# EAGLE schematic module (EAGLE 9.6.2)

## Sheet 1 of 4
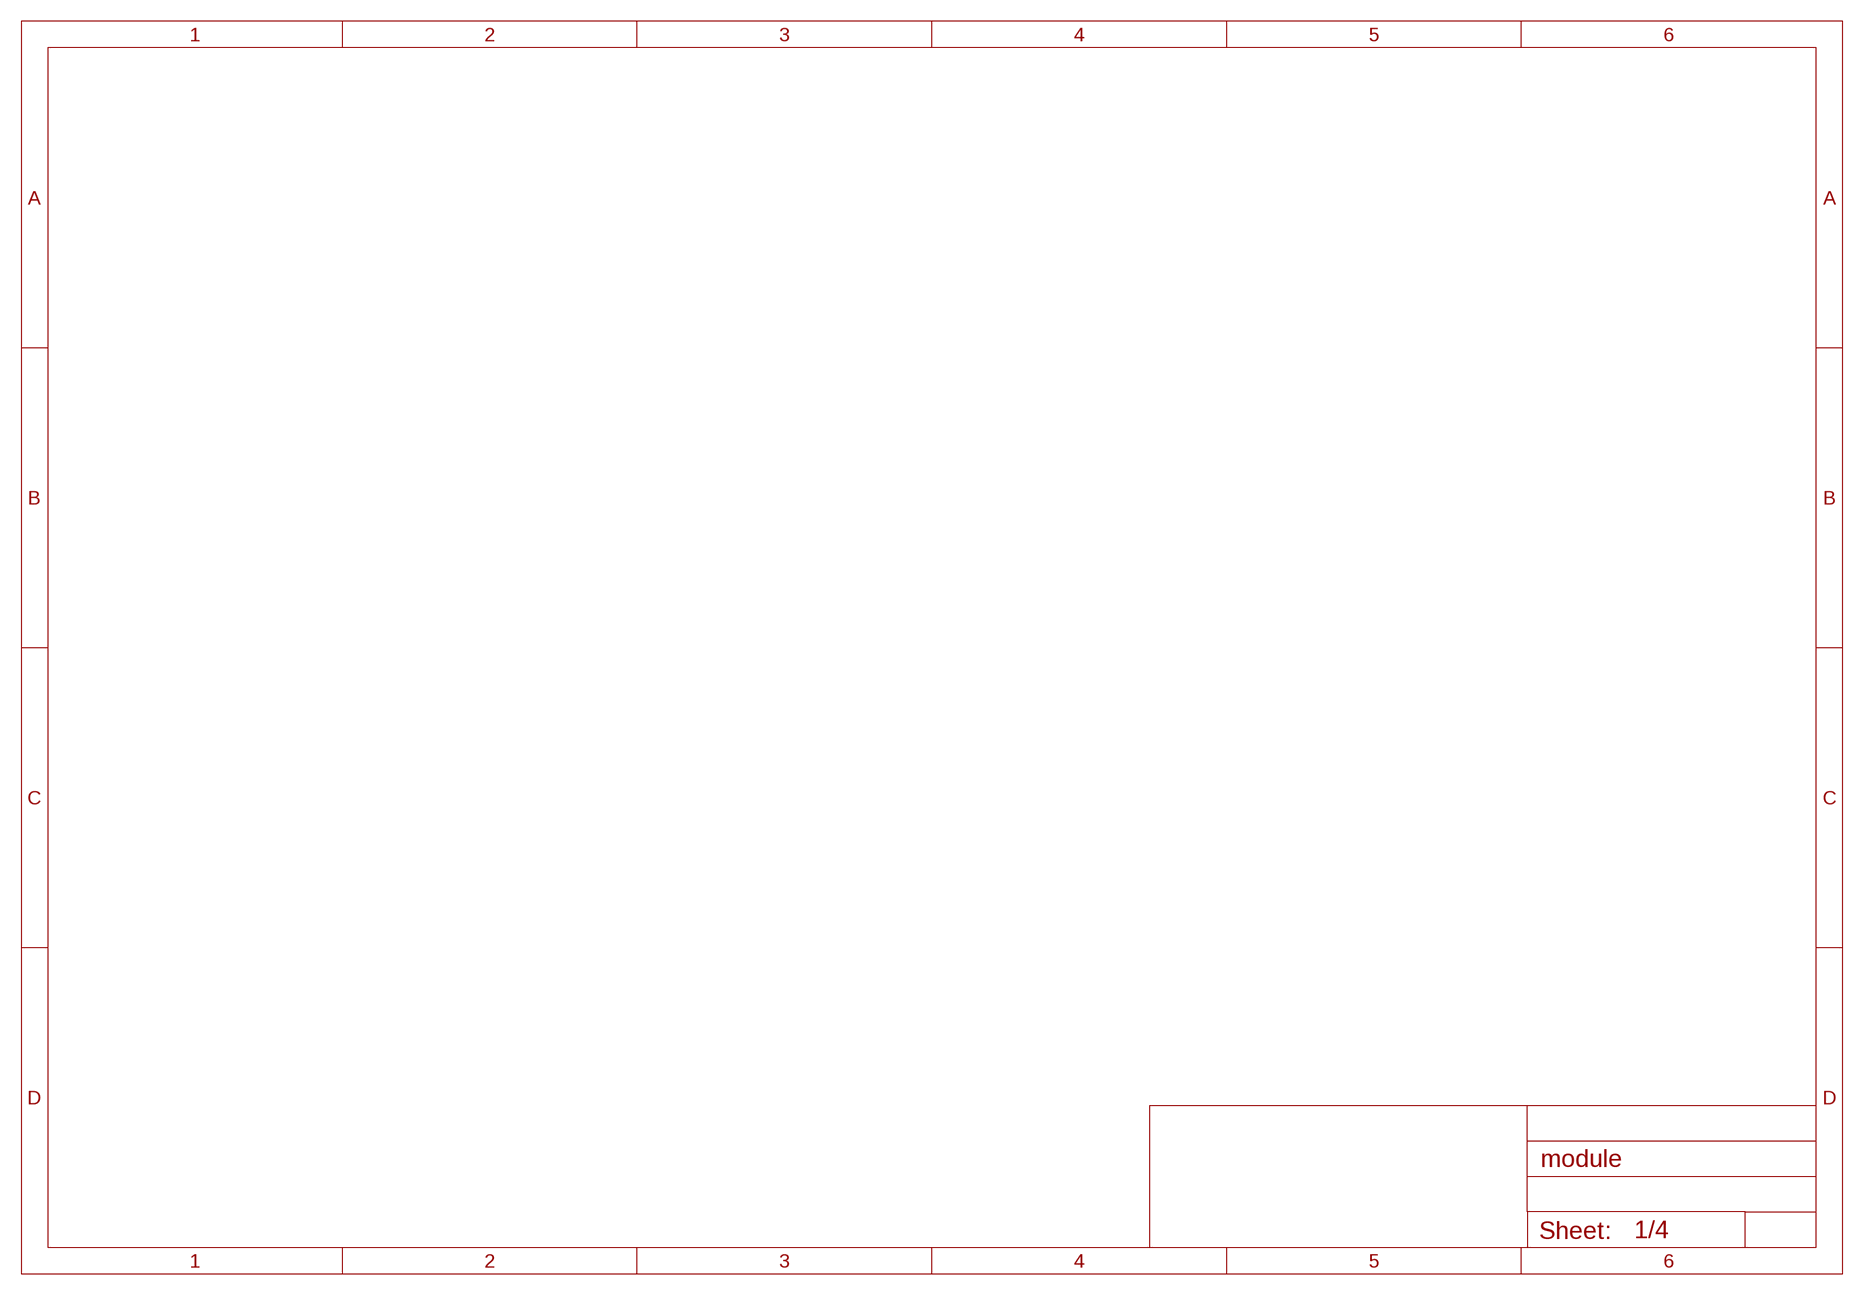
[diagram p0: schematic, sheet 1]

## Sheet 2 of 4
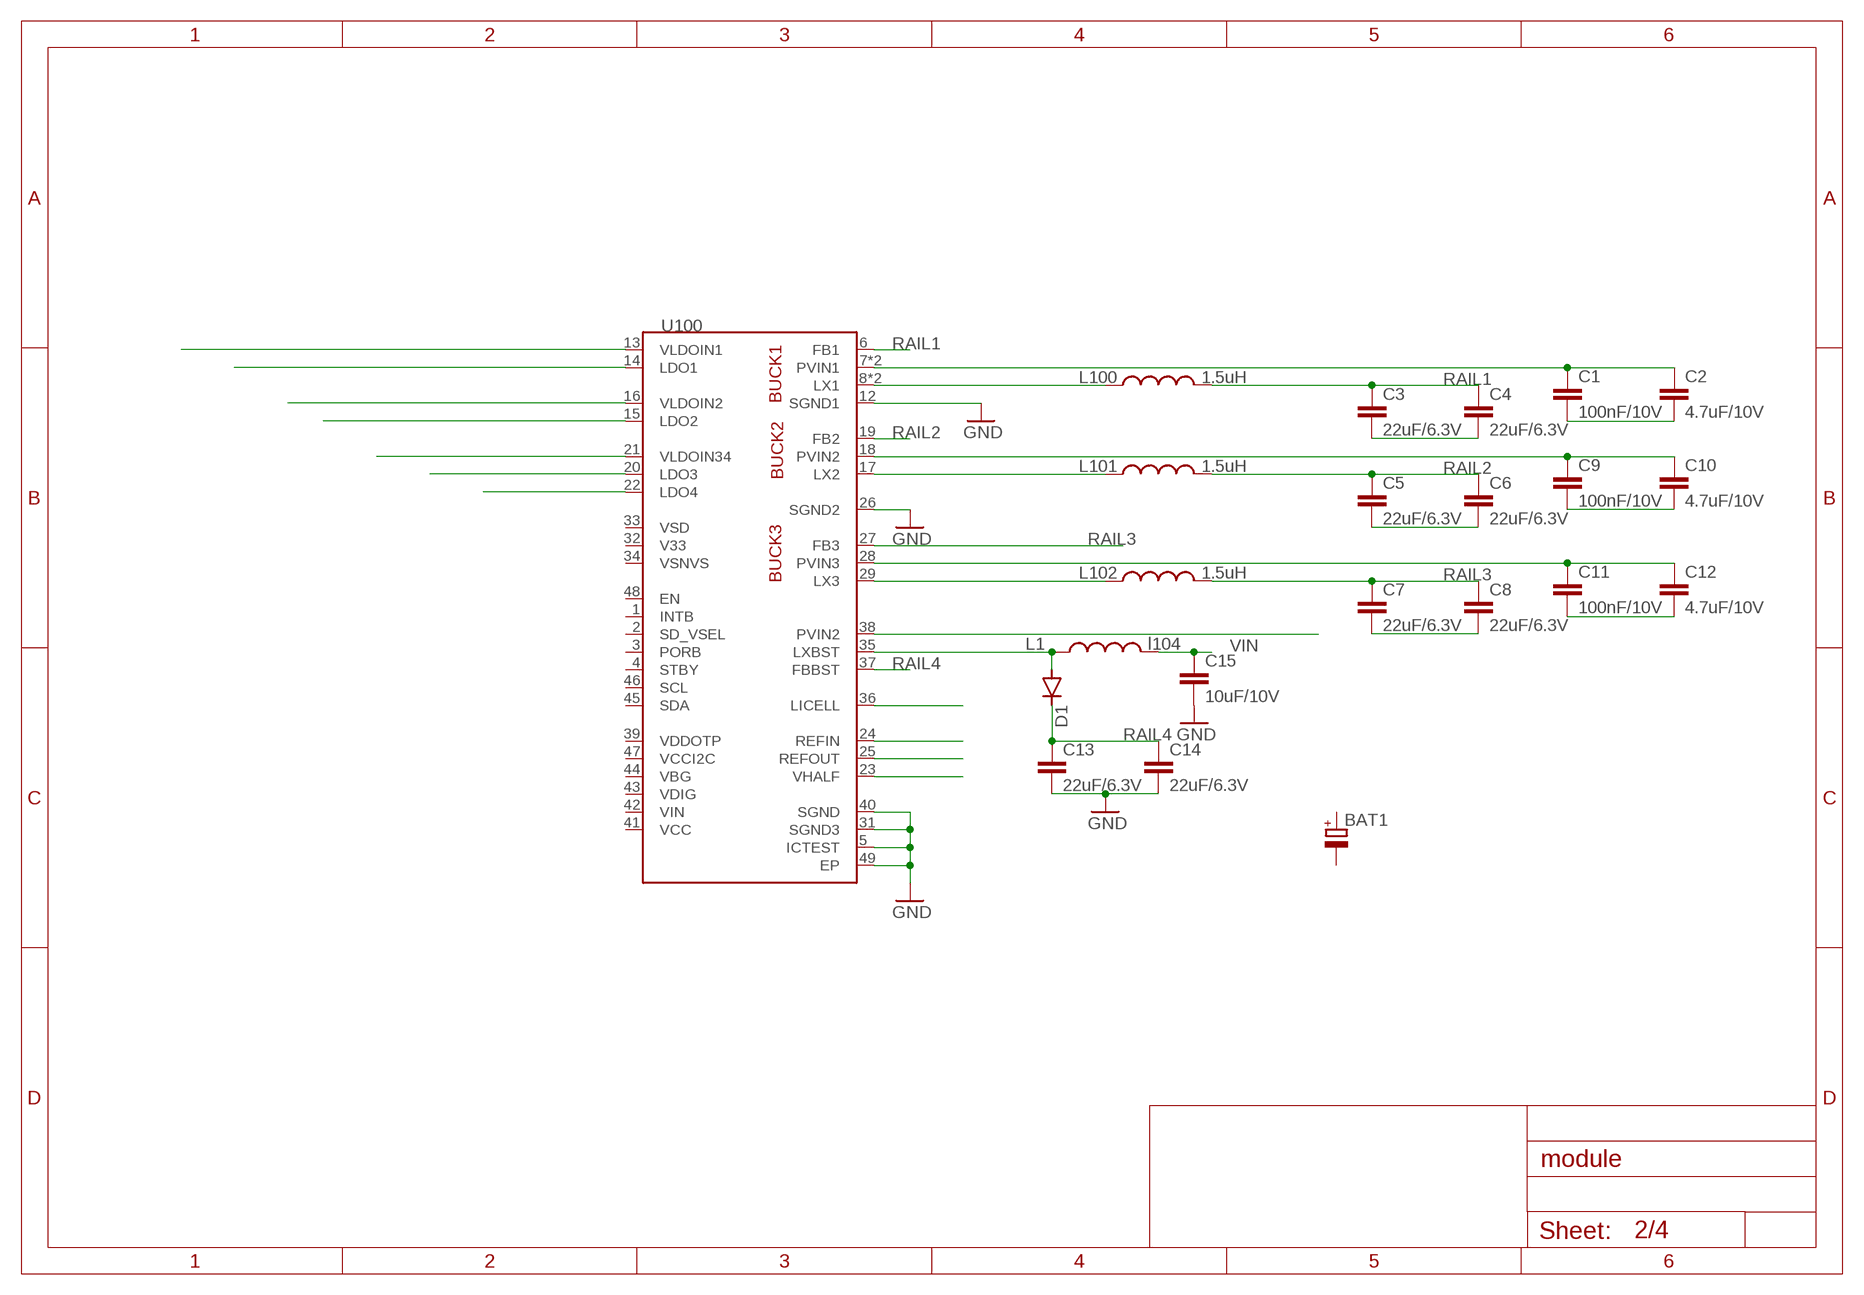
[diagram p1: schematic, sheet 2]

### Parts
BAT1  DCK-3R3E224U-E  [621]
C1  100nF/10V  C-EUC0603  [C0603]
C2  4.7uF/10V  C-EUC0603  [C0603]
C3  22uF/6.3V  C-EUC0805  [C0805]
C4  22uF/6.3V  C-EUC0805  [C0805]
C5  22uF/6.3V  C-EUC0805  [C0805]
C6  22uF/6.3V  C-EUC0805  [C0805]
C7  22uF/6.3V  C-EUC0805  [C0805]
C8  22uF/6.3V  C-EUC0805  [C0805]
C9  100nF/10V  C-EUC0603  [C0603]
C10  4.7uF/10V  C-EUC0603  [C0603]
C11  100nF/10V  C-EUC0603  [C0603]
C12  4.7uF/10V  C-EUC0603  [C0603]
C13  22uF/6.3V  C-EUC0805  [C0805]
C14  22uF/6.3V  C-EUC0805  [C0805]
C15  10uF/10V  C-EUC0805  [C0805]
D1  DIODE-SOD123  [SOD123]
L1  l104  ECS-MPIL50301R5MC  [INDPM5552X300N]
L100  1.5uH  ECS-MPIL50301R5MC  [INDPM5552X300N]
L101  1.5uH  ECS-MPIL50301R5MC  [INDPM5552X300N]
L102  1.5uH  ECS-MPIL50301R5MC  [INDPM5552X300N]
U100  MC34VR5100A1EP  [QFN50P700X700X90-49T410N]

### Nets
GND: C13.2 C14.2 C15.2 U100.5(ICTEST) U100.12(SGND1) U100.26(SGND2) U100.31(SGND3) U100.40(SGND) U100.49(EP)
N$1: L100.1 U100.8(LX1) U100.9(LX1)
N$2: C1.1 C2.1 U100.7(PVIN1) U100.10(PVIN1)
N$3: L101.1 U100.17(LX2)
N$4: L102.1 U100.29(LX3)
N$5: U100.38(PVIN2)
N$6: D1.A L1.1 U100.35(LXBST)
N$7: U100.36(LICELL)
N$8: C9.1 C10.1 U100.18(PVIN2)
N$9: C11.1 C12.1 U100.28(PVIN3)
N$10: C3.2 C4.2
N$11: C1.2 C2.2
N$12: C11.2 C12.2
N$13: C7.2 C8.2
N$14: C5.2 C6.2
N$15: C9.2 C10.2
N$16: U100.24(REFIN)
N$17: U100.25(REFOUT)
N$18: U100.23(VHALF)
N$19: U100.13(VLDOIN1)
N$20: U100.14(LDO1)
N$21: U100.16(VLDOIN2)
N$22: U100.15(LDO2)
N$23: U100.21(VLDOIN34)
N$24: U100.20(LDO3)
N$25: U100.22(LDO4)
RAIL1: C3.1 C4.1 L100.2 U100.6(FB1)
RAIL2: C5.1 C6.1 L101.2 U100.19(FB2)
RAIL3: C7.1 C8.1 L102.2 U100.27(FB3)
RAIL4: C13.1 C14.1 D1.C U100.37(FBBST)
VIN: C15.1 L1.2
Unconnected: BAT1.+ BAT1.- U100.1(INTB) U100.2(SD_VSEL) U100.3(PORB) U100.4(STBY) U100.32(V33) U100.33(VSD) U100.34(VSNVS) U100.39(VDDOTP) U100.41(VCC) U100.42(VIN) U100.43(VDIG) U100.44(VBG) U100.45(SDA) U100.46(SCL) U100.47(VCCI2C) U100.48(EN)

## Sheet 3 of 4
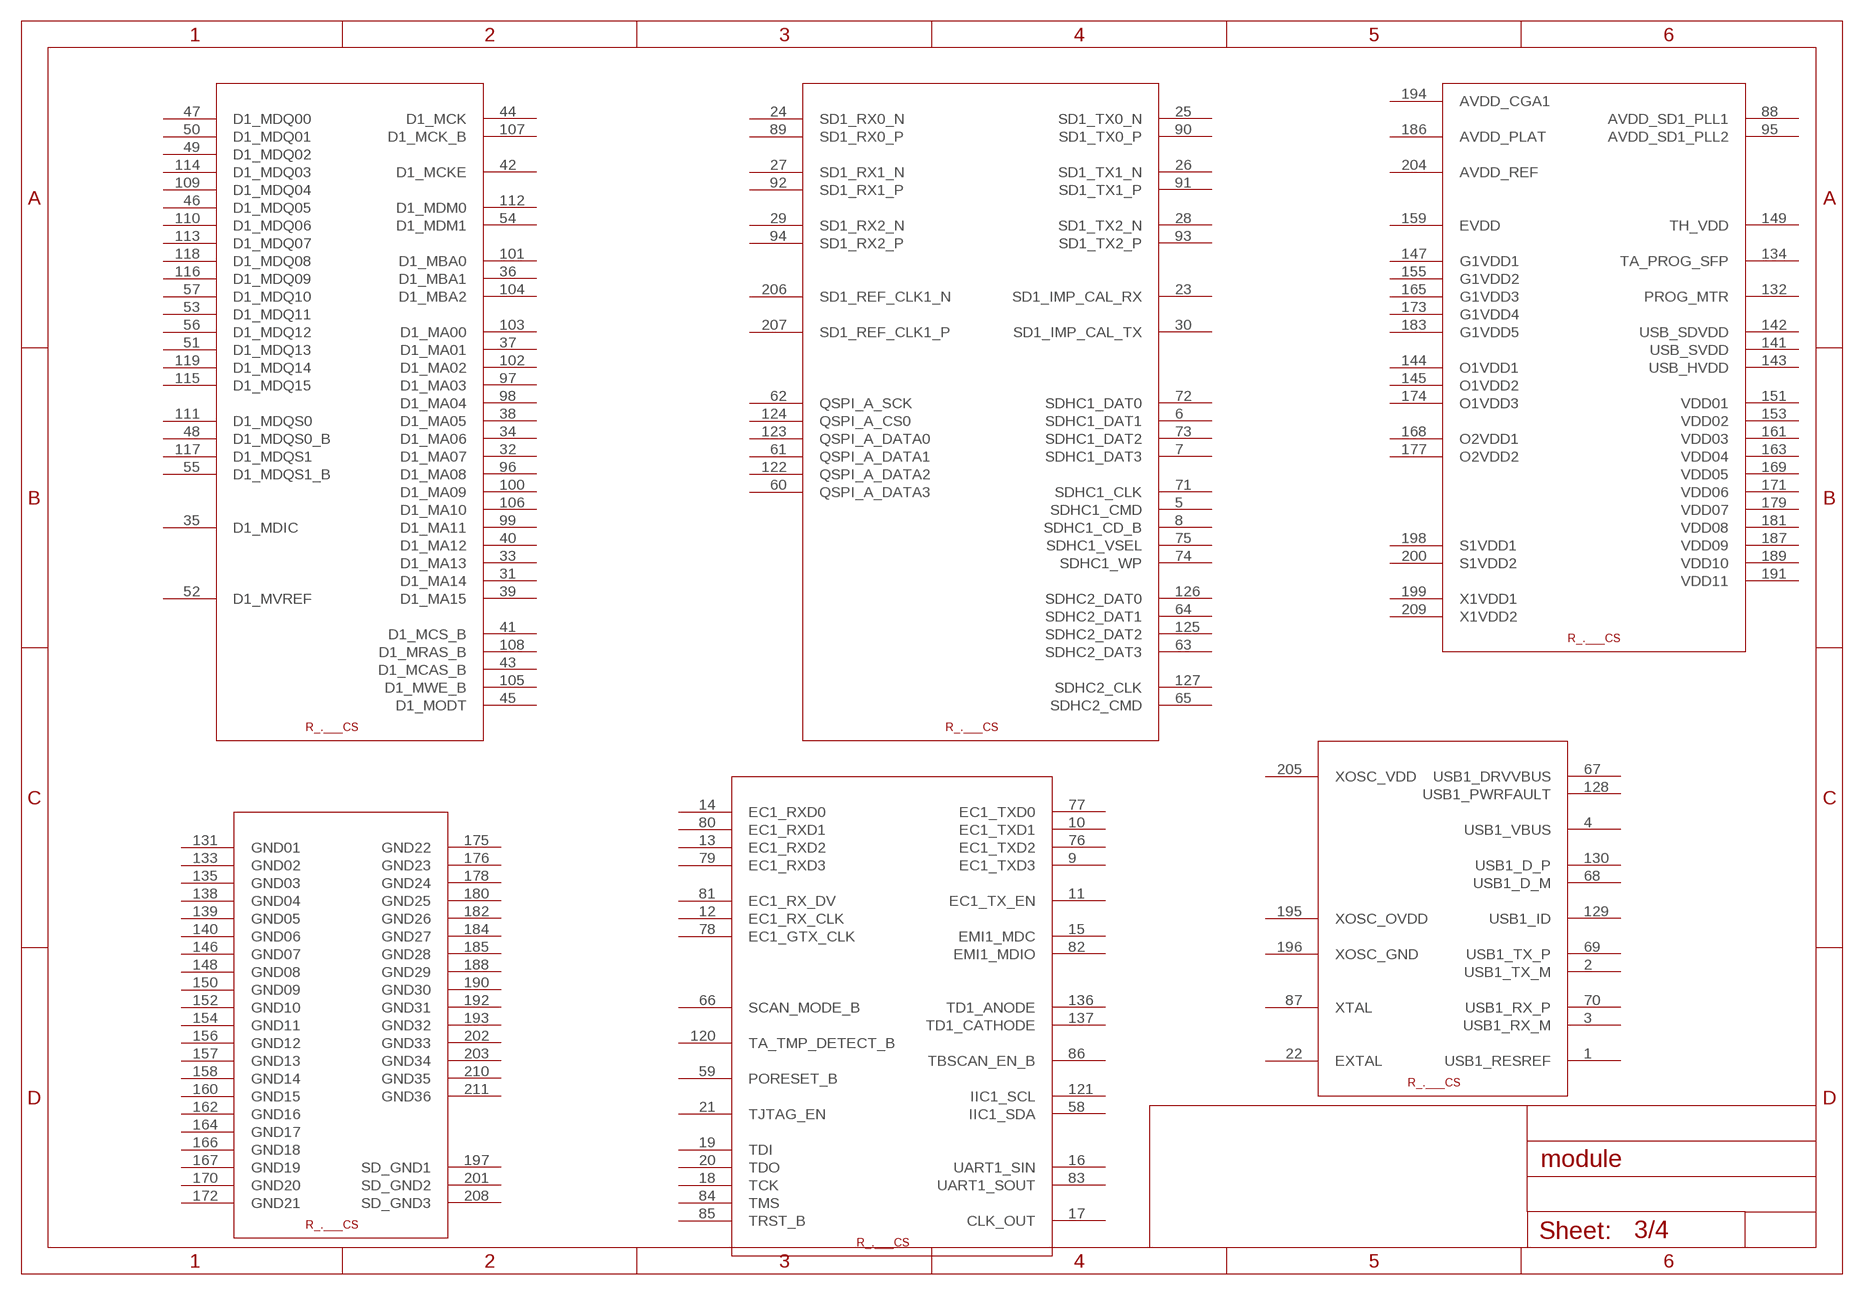
[diagram p2: schematic, sheet 3]

### Parts
U3  LS1012ASE7EKA  [NXP_LS1012ASE7EKA]
Unconnected: U3.1(USB1_RESREF) U3.2(USB1_TX_M) U3.3(USB1_RX_M) U3.4(USB1_VBUS) U3.5(SDHC1_CMD) U3.6(SDHC1_DAT1) U3.7(SDHC1_DAT3) U3.8(SDHC1_CD_B) U3.9(EC1_TXD3) U3.10(EC1_TXD1) U3.11(EC1_TX_EN) U3.12(EC1_RX_CLK) U3.13(EC1_RXD2) U3.14(EC1_RXD0) U3.15(EMI1_MDC) U3.16(UART1_SIN) U3.17(CLK_OUT) U3.18(TCK) U3.19(TDI) U3.20(TDO) U3.21(TJTAG_EN) U3.22(EXTAL) U3.23(SD1_IMP_CAL_RX) U3.24(SD1_RX0_N) U3.25(SD1_TX0_N) U3.26(SD1_TX1_N) U3.27(SD1_RX1_N) U3.28(SD1_TX2_N) U3.29(SD1_RX2_N) U3.30(SD1_IMP_CAL_TX) U3.31(D1_MA14) U3.32(D1_MA07) U3.33(D1_MA13) U3.34(D1_MA06) U3.35(D1_MDIC) U3.36(D1_MBA1) U3.37(D1_MA01) U3.38(D1_MA05) U3.39(D1_MA15) U3.40(D1_MA12) U3.41(D1_MCS_B) U3.42(D1_MCKE) U3.43(D1_MCAS_B) U3.44(D1_MCK) U3.45(D1_MODT) U3.46(D1_MDQ05) U3.47(D1_MDQ00) U3.48(D1_MDQS0_B) U3.49(D1_MDQ02) U3.50(D1_MDQ01) U3.51(D1_MDQ13) U3.52(D1_MVREF) U3.53(D1_MDQ11) U3.54(D1_MDM1) U3.55(D1_MDQS1_B) U3.56(D1_MDQ12) U3.57(D1_MDQ10) U3.58(IIC1_SDA) U3.59(PORESET_B) U3.60(QSPI_A_DATA3) U3.61(QSPI_A_DATA1) U3.62(QSPI_A_SCK) U3.63(SDHC2_DAT3) U3.64(SDHC2_DAT1) U3.65(SDHC2_CMD) U3.66(SCAN_MODE_B) U3.67(USB1_DRVVBUS) U3.68(USB1_D_M) U3.69(USB1_TX_P) U3.70(USB1_RX_P) U3.71(SDHC1_CLK) U3.72(SDHC1_DAT0) U3.73(SDHC1_DAT2) U3.74(SDHC1_WP) U3.75(SDHC1_VSEL) U3.76(EC1_TXD2) U3.77(EC1_TXD0) U3.78(EC1_GTX_CLK) U3.79(EC1_RXD3) U3.80(EC1_RXD1) U3.81(EC1_RX_DV) U3.82(EMI1_MDIO) U3.83(UART1_SOUT) U3.84(TMS) U3.85(TRST_B) U3.86(TBSCAN_EN_B) U3.87(XTAL) U3.89(SD1_RX0_P) U3.90(SD1_TX0_P) U3.91(SD1_TX1_P) U3.92(SD1_RX1_P) U3.93(SD1_TX2_P) U3.94(SD1_RX2_P) U3.96(D1_MA08) U3.97(D1_MA03) U3.98(D1_MA04) U3.99(D1_MA11) U3.100(D1_MA09) U3.101(D1_MBA0) U3.102(D1_MA02) U3.103(D1_MA00) U3.104(D1_MBA2) U3.105(D1_MWE_B) U3.106(D1_MA10) U3.107(D1_MCK_B) U3.108(D1_MRAS_B) U3.109(D1_MDQ04) U3.110(D1_MDQ06) U3.111(D1_MDQS0) U3.112(D1_MDM0) U3.113(D1_MDQ07) U3.114(D1_MDQ03) U3.115(D1_MDQ15) U3.116(D1_MDQ09) U3.117(D1_MDQS1) U3.118(D1_MDQ08) U3.119(D1_MDQ14) U3.120(TA_TMP_DETECT_B) U3.121(IIC1_SCL) U3.122(QSPI_A_DATA2) U3.123(QSPI_A_DATA0) U3.124(QSPI_A_CS0) U3.125(SDHC2_DAT2) U3.126(SDHC2_DAT0) U3.127(SDHC2_CLK) U3.128(USB1_PWRFAULT) U3.129(USB1_ID) U3.130(USB1_D_P) U3.134(TA_PROG_SFP) U3.136(TD1_ANODE) U3.137(TD1_CATHODE) U3.206(SD1_REF_CLK1_N) U3.207(SD1_REF_CLK1_P)

## Sheet 4 of 4
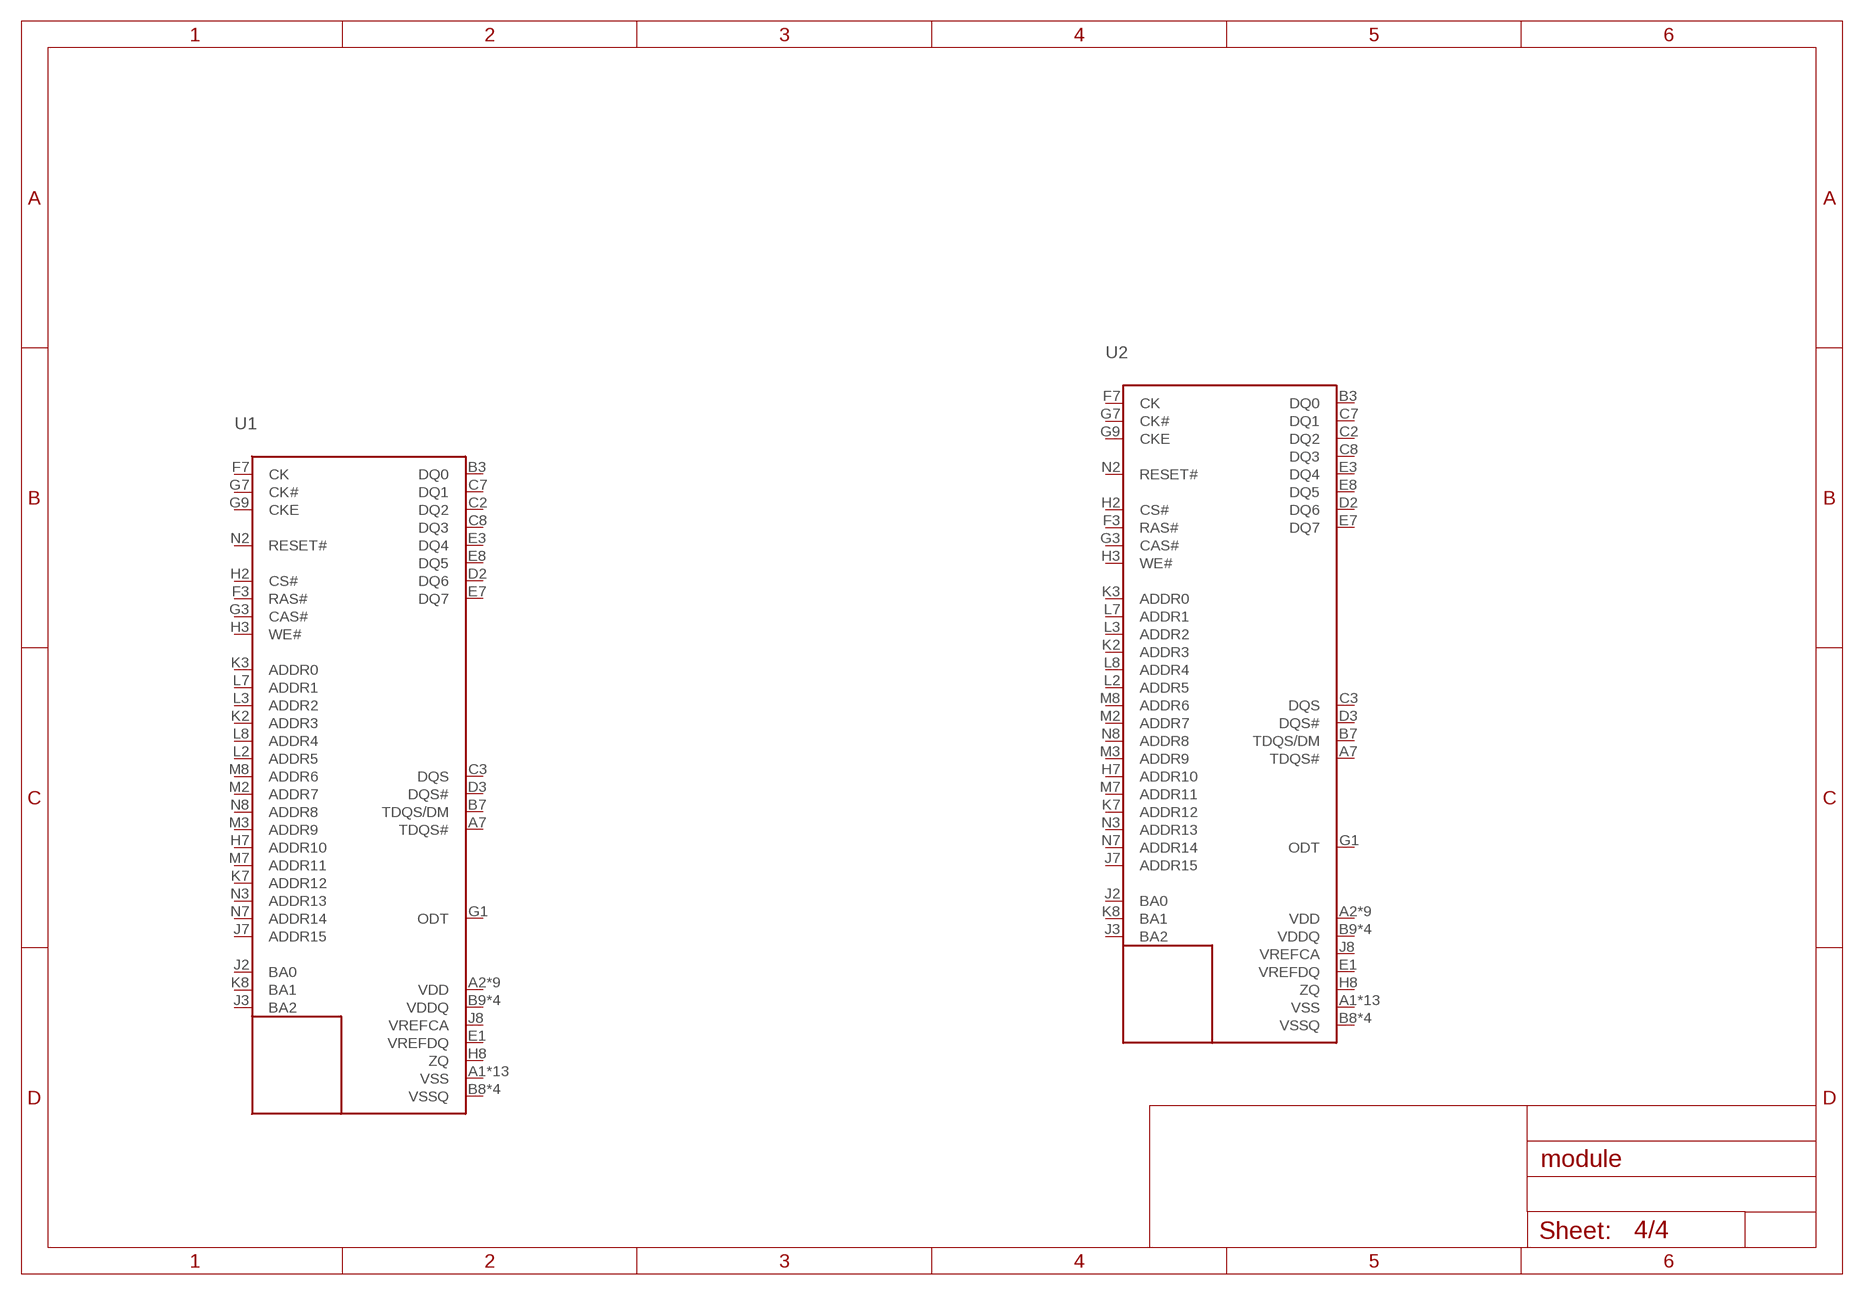
[diagram p3: schematic, sheet 4]

### Parts
U1  MT41K512M8  [BGA78C80P9X13_1050X800X110]
U2  MT41K512M8  [BGA78C80P9X13_1050X800X110]
Unconnected: U1.A1(VSS) U1.A2(VDD) U1.A7(TDQS#) U1.A8(VSS) U1.A9(VDD) U1.B1(VSS) U1.B2(VSS) U1.B3(DQ0) U1.B7(TDQS/DM) U1.B8(VSSQ) U1.B9(VDDQ) U1.C1(VDDQ) U1.C2(DQ2) U1.C3(DQS) U1.C7(DQ1) U1.C8(DQ3) U1.C9(VSSQ) U1.D1(VSSQ) U1.D2(DQ6) U1.D3(DQS#) U1.D7(VDD) U1.D8(VSS) U1.D9(VSSQ) U1.E1(VREFDQ) U1.E2(VDDQ) U1.E3(DQ4) U1.E7(DQ7) U1.E8(DQ5) U1.E9(VDDQ) U1.F2(VSS) U1.F3(RAS#) U1.F7(CK) U1.F8(VSS) U1.G1(ODT) U1.G2(VDD) U1.G3(CAS#) U1.G7(CK#) U1.G8(VDD) U1.G9(CKE) U1.H2(CS#) U1.H3(WE#) U1.H7(ADDR10) U1.H8(ZQ) U1.J1(VSS) U1.J2(BA0) U1.J3(BA2) U1.J7(ADDR15) U1.J8(VREFCA) U1.J9(VSS) U1.K1(VDD) U1.K2(ADDR3) U1.K3(ADDR0) U1.K7(ADDR12) U1.K8(BA1) U1.K9(VDD) U1.L1(VSS) U1.L2(ADDR5) U1.L3(ADDR2) U1.L7(ADDR1) U1.L8(ADDR4) U1.L9(VSS) U1.M1(VDD) U1.M2(ADDR7) U1.M3(ADDR9) U1.M7(ADDR11) U1.M8(ADDR6) U1.M9(VDD) U1.N1(VSS) U1.N2(RESET#) U1.N3(ADDR13) U1.N7(ADDR14) U1.N8(ADDR8) U1.N9(VSS) U2.A1(VSS) U2.A2(VDD) U2.A7(TDQS#) U2.A8(VSS) U2.A9(VDD) U2.B1(VSS) U2.B2(VSS) U2.B3(DQ0) U2.B7(TDQS/DM) U2.B8(VSSQ) U2.B9(VDDQ) U2.C1(VDDQ) U2.C2(DQ2) U2.C3(DQS) U2.C7(DQ1) U2.C8(DQ3) U2.C9(VSSQ) U2.D1(VSSQ) U2.D2(DQ6) U2.D3(DQS#) U2.D7(VDD) U2.D8(VSS) U2.D9(VSSQ) U2.E1(VREFDQ) U2.E2(VDDQ) U2.E3(DQ4) U2.E7(DQ7) U2.E8(DQ5) U2.E9(VDDQ) U2.F2(VSS) U2.F3(RAS#) U2.F7(CK) U2.F8(VSS) U2.G1(ODT) U2.G2(VDD) U2.G3(CAS#) U2.G7(CK#) U2.G8(VDD) U2.G9(CKE) U2.H2(CS#) U2.H3(WE#) U2.H7(ADDR10) U2.H8(ZQ) U2.J1(VSS) U2.J2(BA0) U2.J3(BA2) U2.J7(ADDR15) U2.J8(VREFCA) U2.J9(VSS) U2.K1(VDD) U2.K2(ADDR3) U2.K3(ADDR0) U2.K7(ADDR12) U2.K8(BA1) U2.K9(VDD) U2.L1(VSS) U2.L2(ADDR5) U2.L3(ADDR2) U2.L7(ADDR1) U2.L8(ADDR4) U2.L9(VSS) U2.M1(VDD) U2.M2(ADDR7) U2.M3(ADDR9) U2.M7(ADDR11) U2.M8(ADDR6) U2.M9(VDD) U2.N1(VSS) U2.N2(RESET#) U2.N3(ADDR13) U2.N7(ADDR14) U2.N8(ADDR8) U2.N9(VSS)

## Power pins joined to a net without a drawn wire
AVDD_CGA1: U3.194(AVDD_CGA1)
AVDD_PLAT: U3.186(AVDD_PLAT)
AVDD_REF: U3.204(AVDD_REF)
AVDD_SD1_PLL1: U3.88(AVDD_SD1_PLL1)
AVDD_SD1_PLL2: U3.95(AVDD_SD1_PLL2)
EVDD: U3.159(EVDD)
G1VDD1: U3.147(G1VDD1)
G1VDD2: U3.155(G1VDD2)
G1VDD3: U3.165(G1VDD3)
G1VDD4: U3.173(G1VDD4)
G1VDD5: U3.183(G1VDD5)
GND01: U3.131(GND01)
GND02: U3.133(GND02)
GND03: U3.135(GND03)
GND04: U3.138(GND04)
GND05: U3.139(GND05)
GND06: U3.140(GND06)
GND07: U3.146(GND07)
GND08: U3.148(GND08)
GND09: U3.150(GND09)
GND10: U3.152(GND10)
GND11: U3.154(GND11)
GND12: U3.156(GND12)
GND13: U3.157(GND13)
GND14: U3.158(GND14)
GND15: U3.160(GND15)
GND16: U3.162(GND16)
GND17: U3.164(GND17)
GND18: U3.166(GND18)
GND19: U3.167(GND19)
GND20: U3.170(GND20)
GND21: U3.172(GND21)
GND22: U3.175(GND22)
GND23: U3.176(GND23)
GND24: U3.178(GND24)
GND25: U3.180(GND25)
GND26: U3.182(GND26)
GND27: U3.184(GND27)
GND28: U3.185(GND28)
GND29: U3.188(GND29)
GND30: U3.190(GND30)
GND31: U3.192(GND31)
GND32: U3.193(GND32)
GND33: U3.202(GND33)
GND34: U3.203(GND34)
GND35: U3.210(GND35)
GND36: U3.211(GND36)
O1VDD1: U3.144(O1VDD1)
O1VDD2: U3.145(O1VDD2)
O1VDD3: U3.174(O1VDD3)
O2VDD1: U3.168(O2VDD1)
O2VDD2: U3.177(O2VDD2)
PROG_MTR: U3.132(PROG_MTR)
S1VDD1: U3.198(S1VDD1)
S1VDD2: U3.200(S1VDD2)
SD_GND1: U3.197(SD_GND1)
SD_GND2: U3.201(SD_GND2)
SD_GND3: U3.208(SD_GND3)
TH_VDD: U3.149(TH_VDD)
USB_HVDD: U3.143(USB_HVDD)
USB_SDVDD: U3.142(USB_SDVDD)
USB_SVDD: U3.141(USB_SVDD)
VDD01: U3.151(VDD01)
VDD02: U3.153(VDD02)
VDD03: U3.161(VDD03)
VDD04: U3.163(VDD04)
VDD05: U3.169(VDD05)
VDD06: U3.171(VDD06)
VDD07: U3.179(VDD07)
VDD08: U3.181(VDD08)
VDD09: U3.187(VDD09)
VDD10: U3.189(VDD10)
VDD11: U3.191(VDD11)
X1VDD1: U3.199(X1VDD1)
X1VDD2: U3.209(X1VDD2)
XOSC_GND: U3.196(XOSC_GND)
XOSC_OVDD: U3.195(XOSC_OVDD)
XOSC_VDD: U3.205(XOSC_VDD)

## Library data of the parts
BAT1 = parts-elna:DCK-3R3E224U-E
C1-C15 = rcl:C-EU: CAPACITOR, European symbol; SPICEPREFIX: C
D1 = diode:DIODE-: DIODE
L1 = parts-ecs:ECS-MPIL5030; VALUE: 1.5uH
L100-L102 = parts-ecs:ECS-MPIL5030
U1 U2 = parts-micron:MT41K: DDR3L module x8
U3 = parts-nxp:LS1012ASE7EKA: QorIQ 64-bit ARM MPU, 600MHz Std Temp, PFE 2xGbE PCIe USB3 USB2 SATA3, SEC, 1GHz DDR3L 9.6x9.6mm LGA; AVAILABILITY: Unavailable; DESCRIPTION: QorIQ 64-bit ARM MPU, 600MHz Std Temp, PFE 2xGbE PCIe USB3 USB2 SATA3, SEC, 1GHz DDR3L 9.6x9.6mm LGA; MF: NXP USA; MP: LS1012ASE7EKA; PACKAGE: VFLGA-211 NXP Semiconductors; PRICE: None
U100 = parts-nxp:MC34VR5100: PMIC optimized for LS1012A and LX2160 w/o battery charger